# Altium schematic sheet MZQ-X99-SOLAR-20240924.SchDoc
size A3
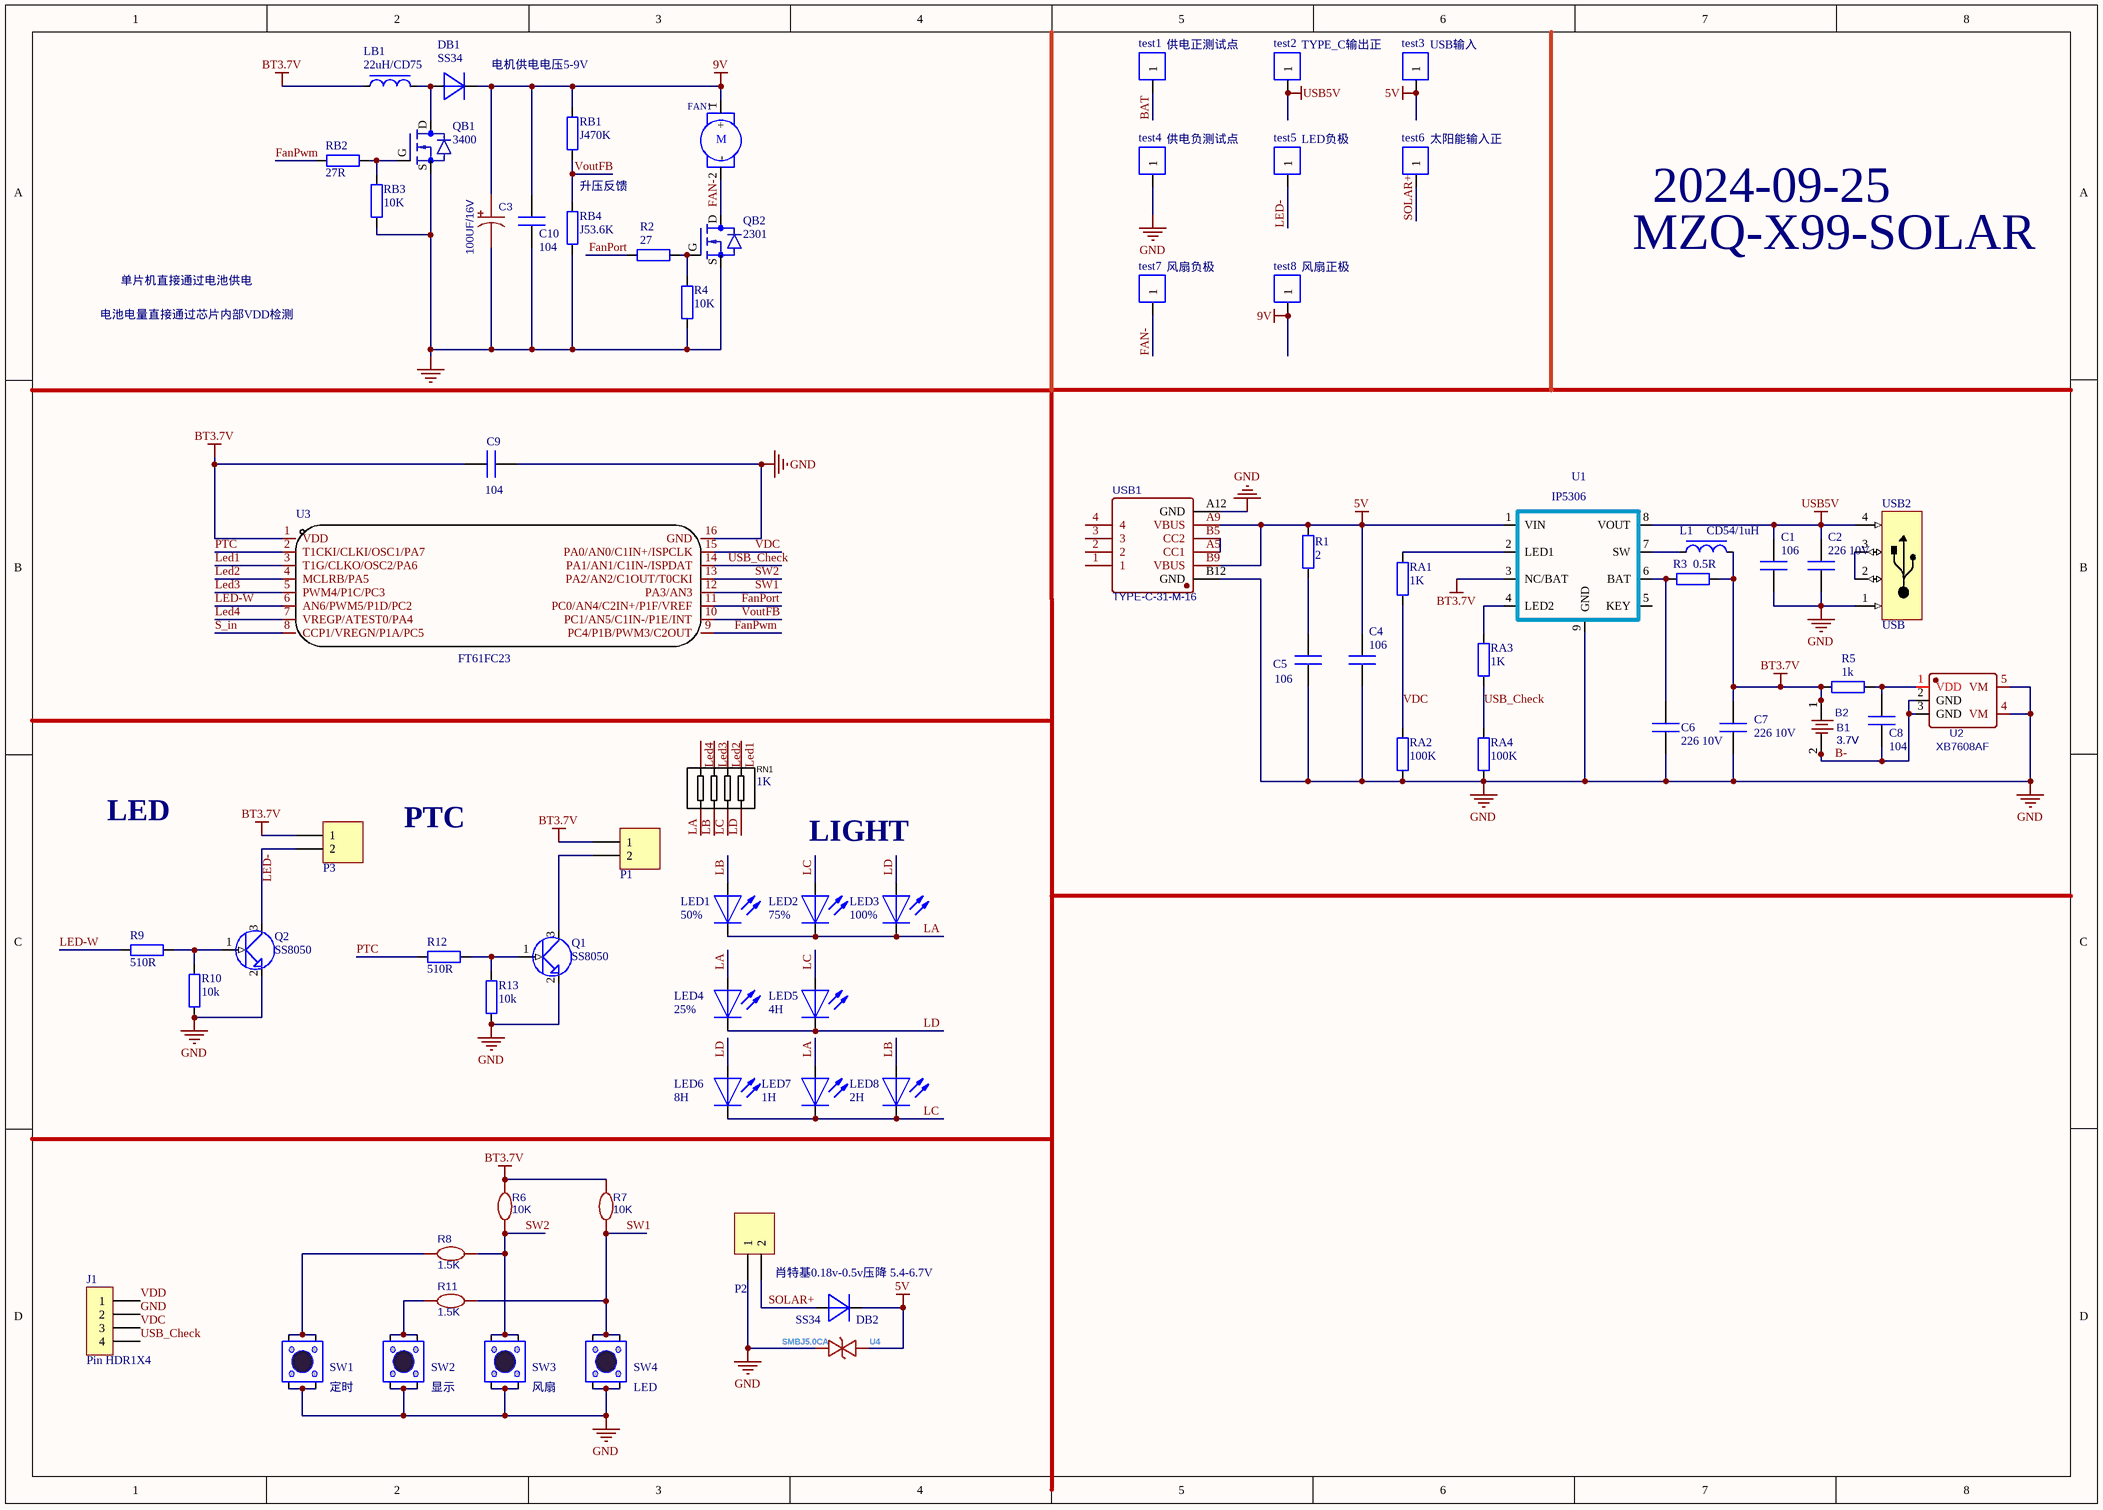
[diagram p0: MZQ-X99-SOLAR-20240924.SchDoc]

## Parts
B1  3.7V  [PH2.0W-2P]
B2  3.7V  [PH2.0W-2P]
C1  106  [0805_C]
C2  226 10V  [0805_C]
C3  100UF/16V  [DIP-EC2.5X6.3X11.2]
C4  106  [0805_C]
C5  106  [0805_C]
C6  226 10V  [0805_C]
C7  226 10V  [0805_C]
C8  104  [0603_C]
C9  104  [0805_C]
C10  104  [0603_C]
DB1  SS34  [SMA(DO-214AC)_S1]
DB2  SS34  [SMA(DO-214AC)_S1]
FAN1  (no value)  [PH2.0W-2P]
J1  Pin HDR1X4  [Pin HDR1X4/2.54mm-S]
L1  CD54/1uH  [CD54]
LB1  22uH/CD75  [CD75]
LED1  50%  [0603_LED_S1]
LED2  75%  [0603_LED_S1]
LED3  100%  [0603_LED_S1]
LED4  25%  [0603_LED_S1]
LED5  4H  [0603_LED_S1]
LED6  8H  [0603_LED_S1]
LED7  1H  [0603_LED_S1]
LED8  2H  [0603_LED_S1]
P1  Header 2  [HP-2]  (value not drawn)
P2  Header 2  [HP-2]  (value not drawn)
P3  Header 2  [HP-2]  (value not drawn)
Q1  SS8050  [SOT-23(SOT-23-3)]
Q2  SS8050  [SOT-23(SOT-23-3)]
QB1  3400  [SOT-23(SOT-23-3)]
QB2  2301  [SOT-23(SOT-23-3)]
R1  2  [0805_R]
R2  27  [0603_R]
R3  0.5R  [0603_R]
R4  10K  [0603_R]
R5  1k  [0603_R]
R6  10K  [0603_R]
R7  10K  [0603_R]
R8  1.5K  [0603_R]
R9  510R  [0603_R]
R10  10k  [0603_R]
R11  1.5K  [0603_R]
R12  510R  [0603_R]
R13  10k  [0603_R]
RA1  1K  [0603_R]
RA2  100K  [0603_R]
RA3  1K  [0603_R]
RA4  100K  [0603_R]
RB1  J470K  [0603_R]
RB2  27R  [0603_R]
RB3  10K  [0603_R]
RB4  J53.6K  [0603_R]
RN1  1K  [排阻(最新)SMT0603*4]
SW1  定时  [SMD-6X6X6]
SW2  显示  [SMD-6X6X6]
SW3  风扇  [SMD-6X6X6]
SW4  LED  [SMD-6X6X6]
test1  供电正测试点  [test3.0_top]
test2  TYPE_C输出正  [test3.0_top]
test3  USB输入  [test3.0_top]
test4  供电负测试点  [test3.0_top]
test5  LED负极  [test3.0_top]
test6  太阳能输入正  [test3.0_top]
test7  风扇负极  [test3.0_top]
test8  风扇正极  [test3.0_top]
U1  IP5306  [SOP-8_EP_150mil]
U2  XB7608AF  [SOT-23-5]
U3  FT61FC23  [SOIC-16_150mil]
U4  SMBJ5.0CA  [SMB_L4.5-W3.6-LS5.2-BI]
USB1  TYPE-C-31-M-16  [USB-C-6]
USB2  USB  [MI-USB-90]

## Nets
5V: C4.2 DB2.2 R1.2 test3.1 U1.1(VIN) U4.2 USB1.A9(VBUS) USB1.B9(VBUS)
9V: C3.1 C10.2 DB1.2 FAN1.1(+) RB1.2 test8.1
BT3.7V: B1.1 B2.1 C7.2 C9.2 L1.2 LB1.1 P1.1 P3.1 R3.1 R5.2 R6.1 R7.1 U1.3(NC/BAT) U3.1(VDD)
GND: C1.1 C2.1 C3.2 C4.1 C5.1 C6.2 C7.1 C9.1 C10.1 J1.2 P2.1 Q1.2(E) Q2.2(E) QB1.3(S) QB2.3(S) R4.1 R10.1 R13.1 RA2.1 RA4.1 RB3.1 RB4.1 SW1.1 SW1.3 SW2.1 SW2.3 SW3.1 SW3.3 SW4.1 SW4.3 test4.1 U1.9(GND) U2.4(VM) U2.5(VM) U3.16(GND) U4.1 USB1.A12(GND) USB1.B12(GND) USB2.1
USB5V: C1.2 C2.2 test2.1 U1.8(VOUT) USB2.4
B-: B1.2 B2.2 C8.1 U2.2(GND) U2.3(GND)
BAT: test1.1
FAN-: FAN1.2(-) QB2.2(G) test7.1
FanPort: R2.2 U3.11(PC0/AN4/C2IN+/P1F/VREF)
FanPwm: RB2.1 U3.9(PC4/P1B/PWM3/C2OUT)
LA: LED1.2 LED2.2 LED3.2 LED4.1 LED7.1 RN1.5
LB: LED1.1 LED8.1 RN1.6
LC: LED2.1 LED5.1 LED6.2 LED7.2 LED8.2 RN1.7
LD: LED3.1 LED4.2 LED5.2 LED6.1 RN1.8
Led1: RN1.1 U3.3(T1G/CLKO/OSC2/PA6)
Led2: RN1.2 U3.4(MCLRB/PA5)
Led3: RN1.3 U3.5(PWM4/P1C/PC3)
Led4: RN1.4 U3.7(VREGP/ATEST0/PA4)
LED-: test5.1
LED-W: R9.1 U3.6(AN6/PWM5/P1D/PC2)
PTC: R12.1 U3.2(T1CKI/CLKI/OSC1/PA7)
S_in: U3.8(CCP1/VREGN/P1A/PC5)
SOLAR+: DB2.1 P2.2 test6.1
SW1: R7.2 R11.2 SW4.2 SW4.4 U3.12(PA3/AN3)
SW2: R6.2 R8.2 SW3.2 SW3.4 U3.13(PA2/AN2/C1OUT/T0CKI)
USB_Check: J1.4 RA3.1 RA4.2 U3.14(PA1/AN1/C1IN-/ISPDAT)
VDC: J1.3 RA1.1 RA2.2 U3.15(PA0/AN0/C1IN+/ISPCLK)
VDD: J1.1
VoutFB: RB1.1 RB4.2 U3.10(PC1/AN5/C1IN-/P1E/INT)
NetC5_2: C5.2 R1.1
NetC6_1: C6.1 R3.2 U1.6(BAT)
NetC8_2: C8.2 R5.1 U2.1(VDD)
NetDB1_1: DB1.1 LB1.2 QB1.2(G)
NetL1_1: L1.1 U1.7(SW)
NetP1_2: P1.2 Q1.3(C)
NetP3_2: P3.2 Q2.3(C)
NetQ1_1: Q1.1(B) R12.2 R13.2
NetQ2_1: Q2.1(B) R9.2 R10.2
NetQB1_1: QB1.1(G) RB2.2 RB3.2
NetQB2_1: QB2.1(G) R2.1 R4.2
NetR8_1: R8.1 SW1.2 SW1.4
NetR11_1: R11.1 SW2.2 SW2.4
NetRA1_2: RA1.2 U1.2(LED1)
NetRA3_2: RA3.2 U1.4(LED2)
NetUSB1_A5: USB1.A5(CC1) USB1.B5(CC2)
NetUSB2_2: USB2.2 USB2.3

Not connected (* = marked no-connect by the designer): U1 5(KEY); USB1 1 2 3 4

## Notes on the sheet
- 电机供电电压5-9V
- 升压反馈
- 2024-09-25
- 电池电量直接通过芯片内部VDD检测
- 单片机直接通过电池供电
- MZQ-X99-SOLAR
- LED
- PTC
- LIGHT
- 肖特基0.18v-0.5v压降 5.4-6.7V
- Labels drawn without touching a wire or pin: LED-
- (in symbol MotorDC-P) M
- (in symbol N MOS) D

## Library data of the parts
B1 B2 = 12V: BOM_Manufacturer: Q&J; BOM_Manufacturer Part: CR1220-2; BOM_Supplier: LCSC; image: //image.lceda.cn/szlcsc/C70381.jpg; BOM_Supplier Part: C70381; spicePre: B; spiceSymbolName: CR1220-2
C1 C2 C4-C10 = Cap
C3 = 220uF/35V: BOM_Manufacturer: BERYL Electronic Tech; BOM_Manufacturer Part: RC050M4R7LO5*11TH-2A1E; nameAlias: Capacitance; Contributor: s-dawn; BOM_Supplier: LCSC; BOM_Supplier Part: C365767; BOM_JLCPCB Part Class: Extended Part; spicePre: C; spiceSymbolName: C1
DB1 DB2 = Diode
FAN1 = MotorDC-P
L1 LB1 = L Core
LED1-LED8 = LED
P1-P3 = Header 2: Header, 2-Pin; LatestRevisionDate: 17-Jul-2002; LatestRevisionNote: Re-released for DXP Platform.; Publisher: Altium Limited
Q1 Q2 = NPN-(EBC如8050 )
QB1 QB2 = N MOS
R1-R5 R9 R10 R12 R13 RA1-RA4 RB1-RB4 = Res
R6-R8 R11 = 1k: Contributor: LCEDA_Lib; spicePre: R; spiceSymbolName: R_0603_EU
RN1 = YC164-JR-070RL: Add into BOM: yes; Power(Watts): 62.5mW; Number of Resistors: 4; Symbol: YC164-JR-070RL; Device: YC164-JR-070RL; Supplier Part: C327053; Manufacturer Part: YC164-JR-070RL; Supplier Footprint: 0603x4; JLCPCB Part Class: Extended Part; Datasheet: https://atta.szlcsc.com/upload/public/pdf/source/20181031/C327053_83904E7E99C831138D2428A732EF3A25.pdf; Supplier: LCSC; Convert to PCB: yes; Number of Pins: 8
SW1-SW4 = SW-4
test1-test8 = 1P
U1 = IC-IP5303
U2 = XB7608AF: Contributor: LCSC; BOM_Supplier: LCSC; BOM_Supplier Part: C249345; BOM_Manufacturer Part: XB7608AF; spicePre: U; spiceSymbolName: XB7608AF
U3 = FT61FC23-RB: Add into BOM: yes; Name: FT61FC23-RB; Symbol: FT61FC23-RB; Device: FT61FC23-RB; LCSC Part Name: FT61FC23-RB; Supplier Part: C2984838; Manufacturer Part: FT61FC23-RB; Supplier Footprint: SOP-16; Datasheet: https://atta.szlcsc.com/upload/public/pdf/source/20220412/81CC0B2D560F8A4F64BD4CAEFEE1BFE1.pdf; Supplier: LCSC; Convert to PCB: yes
U4 = SMBJ5.0CA_C19077559: Manufacturer: 宏迦橙; Add into BOM: yes; polarity: 双向; Reverse Stand-Off Voltage (Vrwm): 5V; Maximum Clamping Voltage: 9.2V; Peak Pulse Current (Ipp)@10/1000us: 65.22A; Peak Pulse Power Dissipation (Ppp)@10/1000us: 600W; Breakdown Voltage: 7V; Reverse Leakage Current (Ir): 800uA; Symbol: SMBJ5.0CA_C19077559; Device: SMBJ5.0CA_C19077559; LCSC Part Name: SMBJ5.0CA; Supplier Part: C19077559; Manufacturer Part: SMBJ5.0CA; Supplier Footprint: SMB; JLCPCB Part Class: Extended Part; Datasheet: https://atta.szlcsc.com/upload/public/pdf/source/20231129/482485C5E60BCB53F84D553F3B29D8A3.pdf; Supplier: LCSC; Convert to PCB: yes; Operating Temperature: -55℃~+155℃; Type: TVS
USB1 = TYPE-C-31-M-16: BOM_Manufacturer: Korean Hroparts Elec; Contributor: LCSC; BOM_Supplier: LCSC; BOM_Supplier Part: C283541; BOM_Manufacturer Part: TYPE-C-31-M-16; BOM_JLCPCB Part Class: Extended Part; spicePre: U; spiceSymbolName: TYPE-C-31-M-16